# Altium schematic sheet Microcontroller.SchDoc
size A4; SheetNumber: 3; SheetTotal: 6
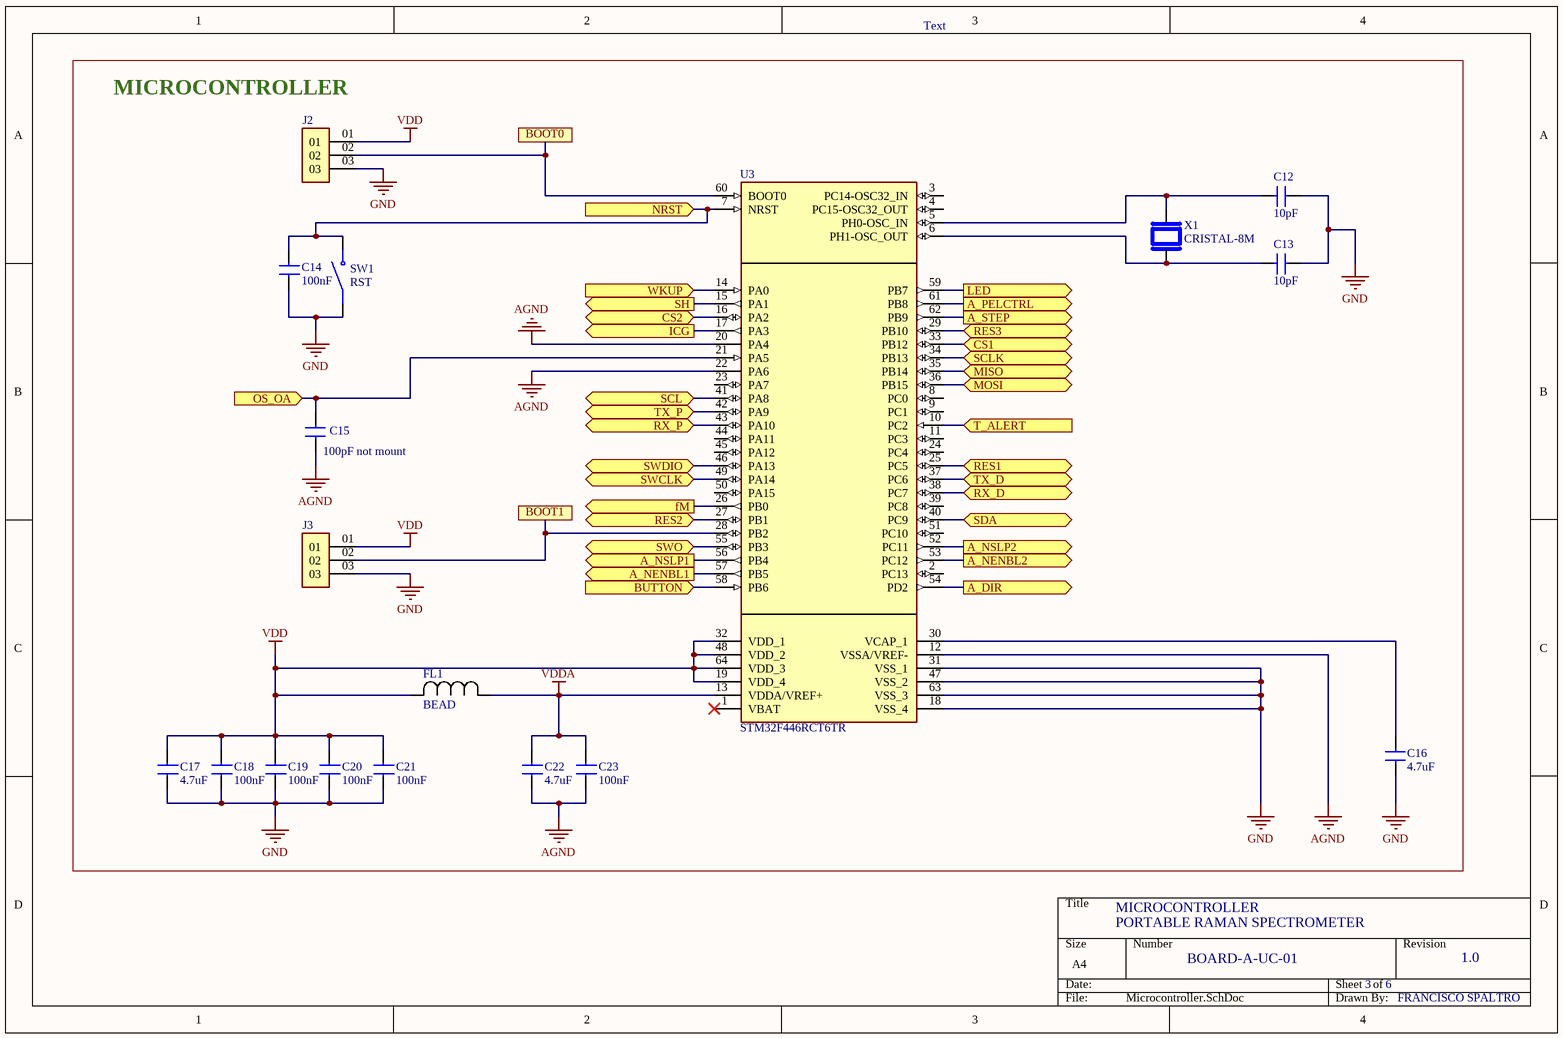
[diagram p0: Microcontroller.SchDoc]

## Parts
C12  10pF  [RES_0805]
C13  10pF  [RES_0805]
C14  100nF  [RES_0805]
C15  100pF not mount  [RES_0805]
C16  4.7uF  [RES_0805]
C17  4.7uF  [RES_0805]
C18  100nF  [RES_0805]
C19  100nF  [RES_0805]
C20  100nF  [RES_0805]
C21  100nF  [RES_0805]
C22  4.7uF  [RES_0805]
C23  100nF  [RES_0805]
FL1  BEAD  [IND_1608_TDK-M]
J2  PIN_HEADER_3  [GEN_PIN3]  (value not drawn)
J3  PIN_HEADER_3  [GEN_PIN3]  (value not drawn)
SW1  RST  [SW_B3U-1000P]
U3  STM32F446RCT6TR  [QFP50P1200X1200X160-64N]
X1  CRISTAL-8M  [XTALDFN320X250X100-2N]

## Blocks framed on the sheet
MICROCONTROLLER: C12-C23 FL1 J2 J3 SW1 U3 X1

## Ports
A_DIR (out, see Main[1A], Out[4C]), A_NENBL1 (out, see Main[1B], Out[4C]), A_NENBL2 (out, see Main[1B], Out[4C]), A_NSLP1 (out, see Main[1B], Out[4C]), A_NSLP2 (out, see Main[1B], Out[4C]), A_PELCTRL (out, see Main[1B], Out[4C]), A_STEP (out, see Main[1B], Out[4C]), BUTTON (in, see Main[2C], Out[1A]), CS1 (bidir, see Main[2B], Out[3B]), CS2 (bidir, see Main[2B], Out[3B]), fM (out, see Main[2C], Out[3C], Sensor[2A]), ICG (out, see Main[2C], Out[3C], Sensor[2A]), LED (out, see Main[2B], Out[1B]), MISO (bidir, see Main[2B], Out[3B]), MOSI (bidir, see Main[2B], Out[3B]), NRST (in, see Main[2B], Out[4B]), OS_OA (in, see Main[1C], Out[3C], Sensor[4B]), RES1 (bidir, see Main[2C], Out[3C]), RES2 (bidir, see Main[2C], Out[3C]), RES3 (bidir, see Main[2C], Out[3C]), RX_D (bidir, see Main[2A], Out[2A]), RX_P (bidir, see Main[2B], Out[2C]), SCL (bidir, see Main[2A], Out[2A], Sensor[1C]), SCLK (bidir, see Main[2B], Out[3B]), SDA (bidir, see Main[2A], Out[2B], Sensor[1C]), SH (out, see Main[1C], Out[3C], Sensor[2A]), SWCLK (bidir, see Main[2B], Out[4B]), SWDIO (bidir, see Main[2B], Out[4B]), SWO (bidir, see Main[2B], Out[4B]), T_ALERT (in, see Main[2C], Sensor[1C]), TX_D (bidir, see Main[2A], Out[2B]), TX_P (bidir, see Main[2B], Out[1C]), WKUP (in, see Main[2B], Out[3C])

## Nets
AGND: C15.1 C22.2 C23.2 U3.12(VSSA/VREF-) U3.20(PA4) U3.22(PA6)
GND: C12.1 C13.1 C14.2 C16.1 C17.2 C18.2 C19.2 C20.2 C21.2 J2.03 J3.03 SW1.1 U3.18(VSS_4) U3.31(VSS_1) U3.47(VSS_2) U3.63(VSS_3)
VDD: C17.1 C18.1 C19.1 C20.1 C21.1 FL1.2 J2.01 J3.01 U3.19(VDD_4) U3.32(VDD_1) U3.48(VDD_2) U3.64(VDD_3)
VDDA: C22.1 C23.1 FL1.1 U3.13(VDDA/VREF+)
A_DIR: U3.54(PD2) ; port A_DIR
A_NENBL1: U3.57(PB5) ; port A_NENBL1
A_NENBL2: U3.53(PC12) ; port A_NENBL2
A_NSLP1: U3.56(PB4) ; port A_NSLP1
A_NSLP2: U3.52(PC11) ; port A_NSLP2
A_PELCTRL: U3.61(PB8) ; port A_PELCTRL
A_STEP: U3.62(PB9) ; port A_STEP
BOOT0: J2.02 U3.60(BOOT0)
BOOT1: J3.02 U3.28(PB2)
BUTTON: U3.58(PB6) ; port BUTTON
CS1: U3.33(PB12) ; port CS1
CS2: U3.16(PA2) ; port CS2
fM: U3.26(PB0) ; port fM
ICG: U3.17(PA3) ; port ICG
LED: U3.59(PB7) ; port LED
MISO: U3.35(PB14) ; port MISO
MOSI: U3.36(PB15) ; port MOSI
NRST: C14.1 SW1.2 U3.7(NRST) ; port NRST
OS_OA: C15.2 U3.21(PA5) ; port OS_OA
RES1: U3.25(PC5) ; port RES1
RES2: U3.27(PB1) ; port RES2
RES3: U3.29(PB10) ; port RES3
RX_D: U3.38(PC7) ; port RX_D
RX_P: U3.43(PA10) ; port RX_P
SCL: U3.41(PA8) ; port SCL
SCLK: U3.34(PB13) ; port SCLK
SDA: U3.40(PC9) ; port SDA
SH: U3.15(PA1) ; port SH
SWCLK: U3.49(PA14) ; port SWCLK
SWDIO: U3.46(PA13) ; port SWDIO
SWO: U3.55(PB3) ; port SWO
T_ALERT: U3.10(PC2) ; port T_ALERT
TX_D: U3.37(PC6) ; port TX_D
TX_P: U3.42(PA9) ; port TX_P
WKUP: U3.14(PA0) ; port WKUP
NetC12_2: C12.2 U3.5(PH0-OSC_IN) X1.2
NetC13_2: C13.2 U3.6(PH1-OSC_OUT) X1.1
NetC16_2: C16.2 U3.30(VCAP_1)

Not connected (* = marked no-connect by the designer): U3 1(VBAT)* 2(PC13) 3(PC14-OSC32_IN) 4(PC15-OSC32_OUT) 8(PC0) 9(PC1) 11(PC3) 23(PA7) 24(PC4) 39(PC8) 44(PA11) 45(PA12) 50(PA15) 51(PC10)

## Notes on the sheet
- Text
- MICROCONTROLLER
- PORTABLE RAMAN SPECTROMETER
- BOARD-A-UC-01
- 3
- 6
- 1.0
- FRANCISCO SPALTRO

## Library data of the parts
C12-C23 = CAP_0805: Generic Capacitor
FL1 = MMZ1608B601CTAH0: INDUCTOR; SMT (0603); FERRITE-BEAD; 600; TOL=+/-25%; 0.5A; -55 DEGC TO +125 DEGC; Manufacturer_Name: TDK; Copyright: Copyright (C) 2025 Ultra Librarian. All rights reserved.; Manufacturer_Part_Number: MMZ1608B601CTAH0
J2 J3 = PIN_HEADER_3: Generic 40 mils drill size, 100 mils step; MF: Samtec Inc.; MP: TS-103-T-A; SnapEDA_Link: https://www.snapeda.com/parts/TS-103-T-A/Samtec+Inc./view-part/?ref=snap; Package: None; Value: *; Check_prices: https://www.snapeda.com/parts/TS-103-T-A/Samtec+Inc./view-part/?ref=eda
SW1 = SW-B3U-1000P: Switch Tactile N.O. SPST Round Button Gull Wing 0.05A 12VDC 1.5N SMD Embossed T/R; Price: None; MP: B3U-1000P; Availability: Unavailable; Value: *; Package: None
U3 = STM32F446RCT6TR: ARM® Cortex®-M4 STM32F4 Microcontroller IC 32-Bit Single-Core 180MHz 256KB (256K x 8) FLASH 64-LQFP (10x10); MF: STMicroelectronics; SnapEDA_Link: https://www.snapeda.com/parts/STM32F446RCT6TR/STMicroelectronics/view-part/?ref=snap; Package: LQFP-64 STMicroelectronics; Value: *; MP: STM32F446RCT6TR; Check_prices: https://www.snapeda.com/parts/STM32F446RCT6TR/STMicroelectronics/view-part/?ref=eda
X1 = CRISTAL-CG04874-8M: 8 MHz ±20ppm Crystal 8pF 500 Ohms 2-SMD, No Lead; MF: NDK America, Inc.; SnapEDA_Link: https://www.snapeda.com/parts/CG04874-8M/NDK+America%252C+Inc./view-part/?ref=snap; Package: SMD-2 NDK America,; Value: *; MP: CG04874-8M; Check_prices: https://www.snapeda.com/parts/CG04874-8M/NDK+America%252C+Inc./view-part/?ref=eda